# EAGLE design screwshield-digital-3.5mm (EAGLE 5.04)
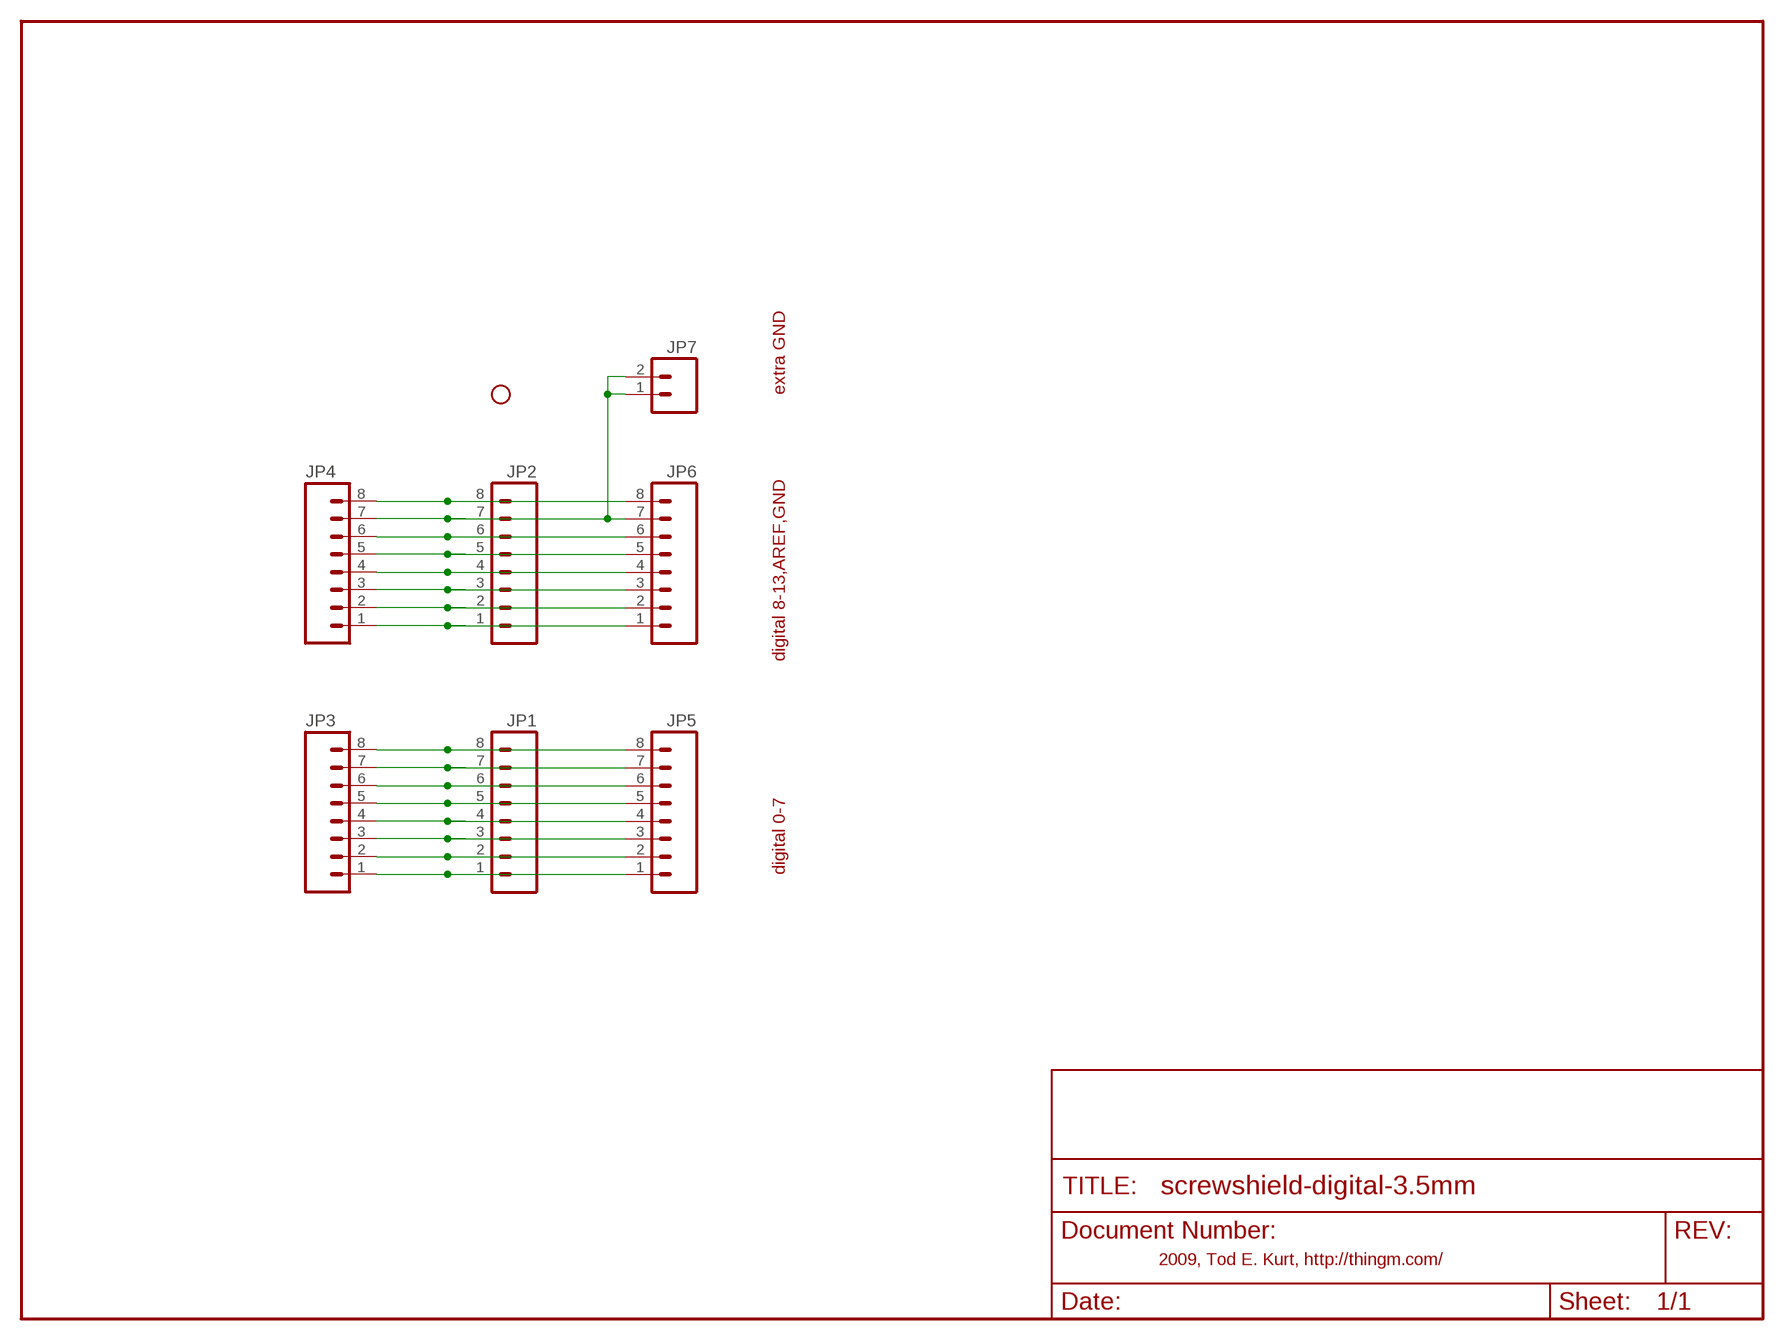
[diagram p0: schematic, sheet 1]

## Parts
JP1  M08LOCK_LONGPADS  [1X08_LOCK_LONGPADS]
JP2  M08LOCK_LONGPADS  [1X08_LOCK_LONGPADS]
JP3  M08LOCK_LONGPADS  [1X08_LOCK_LONGPADS]
JP4  M08LOCK_LONGPADS  [1X08_LOCK_LONGPADS]
JP5  M08-SCREWTERMINAL  [SCREWTERMINAL-3.5MM-8]
JP6  M08-SCREWTERMINAL  [SCREWTERMINAL-3.5MM-8]
JP7  M023.5MM  [SCREWTERMINAL-3.5MM-2]
U$1  STAND-OFF  [STAND-OFF]

## Nets
GND: JP2.7 JP4.7 JP6.7 JP7.1 JP7.2
N$1: JP2.8 JP4.8 JP6.8
N$3: JP2.6 JP4.6 JP6.6
N$4: JP2.5 JP4.5 JP6.5
N$5: JP2.4 JP4.4 JP6.4
N$6: JP2.3 JP4.3 JP6.3
N$7: JP2.2 JP4.2 JP6.2
N$8: JP2.1 JP4.1 JP6.1
N$9: JP1.8 JP3.8 JP5.8
N$10: JP1.7 JP3.7 JP5.7
N$11: JP1.6 JP3.6 JP5.6
N$12: JP1.4 JP3.4 JP5.4
N$13: JP1.5 JP3.5 JP5.5
N$14: JP1.3 JP3.3 JP5.3
N$15: JP1.2 JP3.2 JP5.2
N$16: JP1.1 JP3.1 JP5.1

## Notes on the sheet
- extra GND
- digital 8-13,AREF,GND
- digital 0-7
- 2009, Tod E. Kurt, http://thingm.com/

## Library data of the parts
JP1-JP4 = SparkFun-20090108:M08: Header 8 Standard 8-pin 0.1" header. Use with straight break away headers (SKU : PRT-00116), right angle break away headers (PRT-00553), swiss pins (PRT-00743), machine pins (PRT-00117), and female headers (PRT-00115).
JP5 JP6 = todstuff:M08-SCREWTERMINAL
JP7 = SparkFun-20090108:M02: Header 2 Standard 2-pin 0.1" header. Use with straight break away headers (SKU : PRT-00116), right angle break away headers (PRT-00553), swiss pins (PRT-00743), machine pins (PRT-00117), and female headers (PRT-00115). Molex polarized connector foot print use with SKU : PRT-08233 with associated crimp pins and housings.
U$1 = SparkFun-20090108:STAND-OFF: Stand Off This is the mechanical footprint for a #4 phillips button head screw. Use the keepout ring to avoid running the screw head into surrounding components. SKU : PRT-00447

## Board
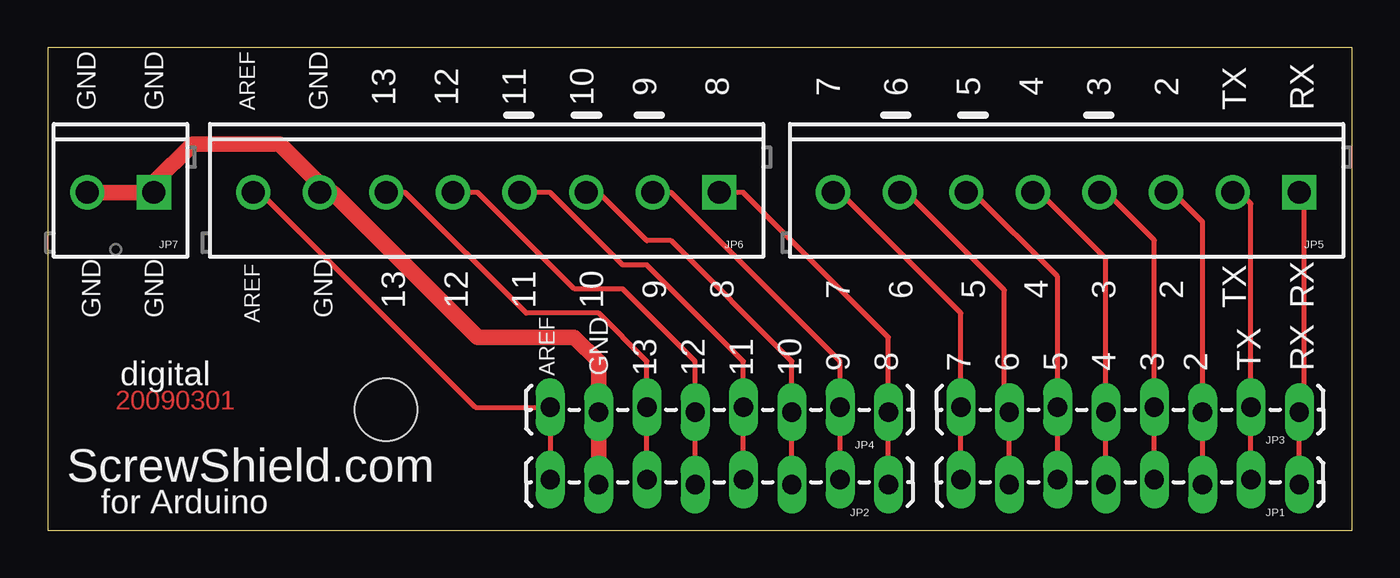
[diagram p1: board, top side]

Size 68.58 x 25.4 mm. Coordinates in mm from the lower left corner, seen from the top.
Outline: 0,0 68.58,0 68.58,25.4 0,25.4 0,0
Copper layers (1*16): Top 0.035mm / dielectric 1.5mm / Bottom 0.035mm
Design rules "default": minimum track width 10mil, minimum drill 24mil, track to track 8mil, track to pad 8mil, pad to pad 8mil, via to via 8mil, smd to smd 8mil, copper to edge 40mil, drill to drill 8mil, minimum pad ring 10mil, minimum via ring 8mil, stop-mask expansion 4mil, vias tented up to drill 0mil, thermal gap 10mil

### Footprints (pad centres in the part's own frame; a part is rotated, then mirrored left to right if it is on the bottom)
1X08_LOCK_LONGPADS = drill 1.016 long: 1 0,0.127; 2 2.54,-0.127; 3 5.08,0.127; 4 7.62,-0.127; 5 10.16,0.127; 6 12.7,-0.127; 7 15.24,0.127; 8 17.78,-0.127
SCREWTERMINAL-3.5MM-8 = drill 1.2 square: 1 0,0 | drill 1.2 round: 2 3.5,0; 3 7,0; 4 10.5,0; 5 14,0; 6 17.5,0; 7 21,0; 8 24.5,0
SCREWTERMINAL-3.5MM-2 = drill 1.2 square: 1 0,0 | drill 1.2 round: 2 3.5,0
STAND-OFF = hole 3.302: 0,0

### Placement (x,y rotation side)
JP1  65.79,2.54 180 top
JP2  44.2,2.54 180 top
JP3  65.79,6.35 180 top
JP4  44.2,6.35 180 top
JP5  65.79,17.78 180 top
JP6  35.31,17.78 180 top
JP7  5.59,17.78 180 top
U$1  17.78,6.35 0 top

### Tracks (layer width: path | path; a pad name or v marks a point on that pad's centre or on a via)
GND
  Top 0.254: 14.22,18.29 14.31,18.21
  Top 0.813: 14.22,18.29 12.7,19.81 12.19,20.32 7.62,20.32 5.59,18.29 JP7.1 JP7.2 | JP2.7 JP4.7 28.96,8.89 27.69,10.16 22.61,10.16 14.99,17.78 JP6.7 14.31,18.21
N$1
  Top 0.254: JP2.8 JP4.8 22.48,6.48 11.18,17.78 JP6.8
N$3
  Top 0.254: JP2.6 JP4.6 31.5,8.89 28.96,11.43 25.15,11.43 18.8,17.78 JP6.6
N$4
  Top 0.254: JP2.5 JP4.5 34.04,8.89 30.23,12.7 27.69,12.7 22.61,17.78 JP6.5
N$5
  Top 0.254: JP2.4 JP4.4 36.58,8.89 31.5,13.97 30.23,13.97 26.42,17.78 JP6.4
N$6
  Top 0.254: JP2.3 JP4.3 39.12,8.89 32.77,15.24 31.5,15.24 28.96,17.78 JP6.3
N$7
  Top 0.254: JP2.2 JP4.2 41.66,8.89 32.77,17.78 JP6.2
N$8
  Top 0.254: JP2.1 JP4.1 44.2,10.16 36.58,17.78 JP6.1
N$9
  Top 0.254: JP1.8 JP3.8 48.01,11.43 41.66,17.78 JP5.8
N$10
  Top 0.254: JP1.7 JP3.7 50.29,7.62 50.29,12.64 45.16,17.78 JP5.7
N$11
  Top 0.254: JP1.6 JP3.6 53.09,13.35 48.66,17.78 JP5.6
N$12
  Top 0.254: JP1.4 JP3.4 58.17,15.27 55.66,17.78 JP5.4
N$13
  Top 0.254: JP1.5 JP3.5 55.63,14.31 52.16,17.78 JP5.5
N$14
  Top 0.254: JP1.3 JP3.3 60.71,16.23 59.16,17.78 JP5.3
N$15
  Top 0.254: JP1.2 JP3.2 63.25,17.19 62.66,17.78 JP5.2
N$16
  Top 0.254: JP1.1 JP3.1 66.04,7.62 66.04,17.02 65.79,17.27 JP5.1

### Text on the board
Top: 20090301
tPlace: 9 | 8 | 7 | 6 | 5 | 4 | 3 | 2 | GND | GND | AREF | GND | 13 | 12 | 11 | 10 | TX | RX | 13 | 12 | 11 | 10 | 9 | 8 | 7 | 6 | 5 | 4 | 3 | 2 | TX | RX | GND | GND | AREF | GND | digital | AREF | GND | 13 | 12 | 11 | 10 | 9 | 8 | 7 | 6 | 5 | 4 | 3 | 2 | TX | RX | ScrewShield.com | for Arduino